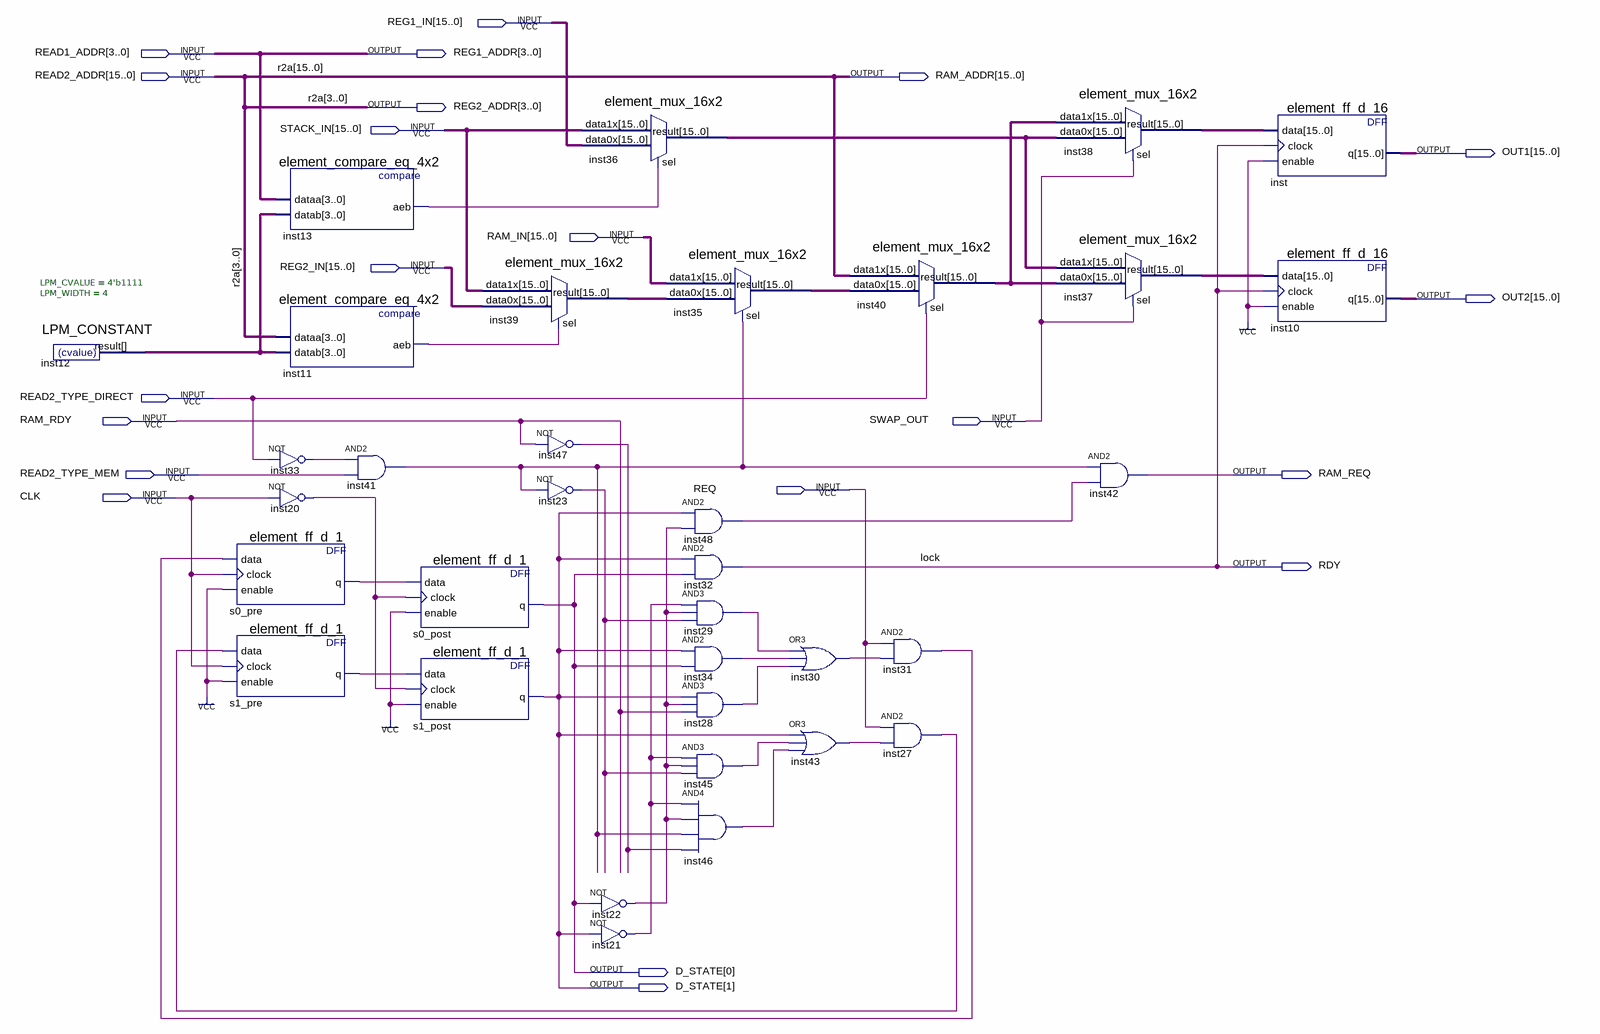
[diagram p0: schematic sheet]
// Quartus schematic block-stage-data-read.bdf as structural Verilog: 34 symbols, 21 pins
module \block-stage-data-read  (
  input  [15:0] REG1_IN,
  input  [3:0] READ1_ADDR,
  input  [15:0] READ2_ADDR,
  input  [15:0] STACK_IN,
  input  [15:0] RAM_IN,
  input  [15:0] REG2_IN,
  input  READ2_TYPE_DIRECT,
  input  RAM_RDY,
  input  SWAP_OUT,
  input  READ2_TYPE_MEM,
  input  REQ,
  input  CLK,
  output [3:0] REG1_ADDR,
  output [15:0] RAM_ADDR,
  output [3:0] REG2_ADDR,
  output [15:0] OUT1,
  output [15:0] OUT2,
  output RAM_REQ,
  output RDY,
  output [1:0] D_STATE
);

  wire inst11_aeb, inst13_aeb, inst20_out, inst21_out, inst22_out, inst23_out, inst27_out, inst28_out,
       inst29_out, inst30_out, inst31_out, inst33_out, inst34_out, inst41_out, inst43_out, inst45_out,
       inst46_out, inst47_out, inst48_out, s0_pre_q, s1_pre_q;
  wire [3:0] inst12_result;
  wire [15:0] inst35_result, inst36_result, inst37_result, inst38_result, inst39_result, inst40_result;

  LPM_CONSTANT #(.LPM_CVALUE(4'b1111), .LPM_WIDTH(4)) inst12 (.result(inst12_result));
  element_ff_d_1 s0_pre (.data(inst31_out), .clock(CLK), .enable(1'b1), .q(s0_pre_q));
  element_ff_d_1 s1_pre (.data(inst27_out), .clock(CLK), .enable(1'b1), .q(s1_pre_q));
  element_compare_eq_4x2 inst13 (.dataa(READ1_ADDR), .datab(inst12_result), .aeb(inst13_aeb));
  element_compare_eq_4x2 inst11 (.dataa(READ2_ADDR[3:0]), .datab(inst12_result), .aeb(inst11_aeb));
  not inst33 (inst33_out, READ2_TYPE_DIRECT);
  not inst20 (inst20_out, CLK);
  and inst41 (inst41_out, inst33_out, READ2_TYPE_MEM);
  element_ff_d_1 s0_post (.data(s0_pre_q), .clock(inst20_out), .enable(1'b1), .q(D_STATE[0]));
  element_ff_d_1 s1_post (.data(s1_pre_q), .clock(inst20_out), .enable(1'b1), .q(D_STATE[1]));
  element_mux_16x2 inst39 (.data1x(STACK_IN), .data0x(REG2_IN), .sel(inst11_aeb), .result(inst39_result));
  not inst47 (inst47_out, RAM_RDY);
  not inst23 (inst23_out, inst41_out);
  element_mux_16x2 inst36 (.data1x(STACK_IN), .data0x(REG1_IN), .sel(inst13_aeb), .result(inst36_result));
  not inst22 (inst22_out, D_STATE[0]);
  not inst21 (inst21_out, D_STATE[1]);
  element_mux_16x2 inst35 (.data1x(RAM_IN), .data0x(inst39_result), .sel(inst41_out), .result(inst35_result));
  and inst48 (inst48_out, D_STATE[1], inst22_out);
  and inst32 (RDY, D_STATE[1], D_STATE[0]);
  and inst29 (inst29_out, inst21_out, inst22_out, inst23_out);
  and inst34 (inst34_out, D_STATE[1], D_STATE[0]);
  and inst28 (inst28_out, D_STATE[1], inst22_out, RAM_RDY);
  and inst45 (inst45_out, inst21_out, inst22_out, inst23_out);
  and inst46 (inst46_out, inst21_out, inst22_out, inst41_out, inst47_out);
  or inst30 (inst30_out, inst29_out, inst34_out, inst28_out);
  or inst43 (inst43_out, D_STATE[1], inst45_out, inst46_out);
  element_mux_16x2 inst40 (
    .data1x(READ2_ADDR), .data0x(inst35_result), .sel(READ2_TYPE_DIRECT), .result(inst40_result));
  and inst31 (inst31_out, REQ, inst30_out);
  and inst27 (inst27_out, REQ, inst43_out);
  element_mux_16x2 inst38 (.data1x(inst40_result), .data0x(inst36_result), .sel(SWAP_OUT), .result(inst38_result));
  element_mux_16x2 inst37 (.data1x(inst36_result), .data0x(inst40_result), .sel(SWAP_OUT), .result(inst37_result));
  and inst42 (RAM_REQ, inst41_out, inst48_out);
  element_ff_d_16 inst (.data(inst38_result), .clock(RDY), .enable(1'b1), .q(OUT1));
  element_ff_d_16 inst10 (.data(inst37_result), .clock(RDY), .enable(1'b1), .q(OUT2));

  assign RAM_ADDR = READ2_ADDR;
  assign REG1_ADDR = READ1_ADDR;
  assign REG2_ADDR = READ2_ADDR[3:0];

  // Other names for the same wires on the sheet: lock = RDY; r2a[15:0] = READ2_ADDR
endmodule
